# EAGLE schematic chaves (EAGLE 7.6.0)
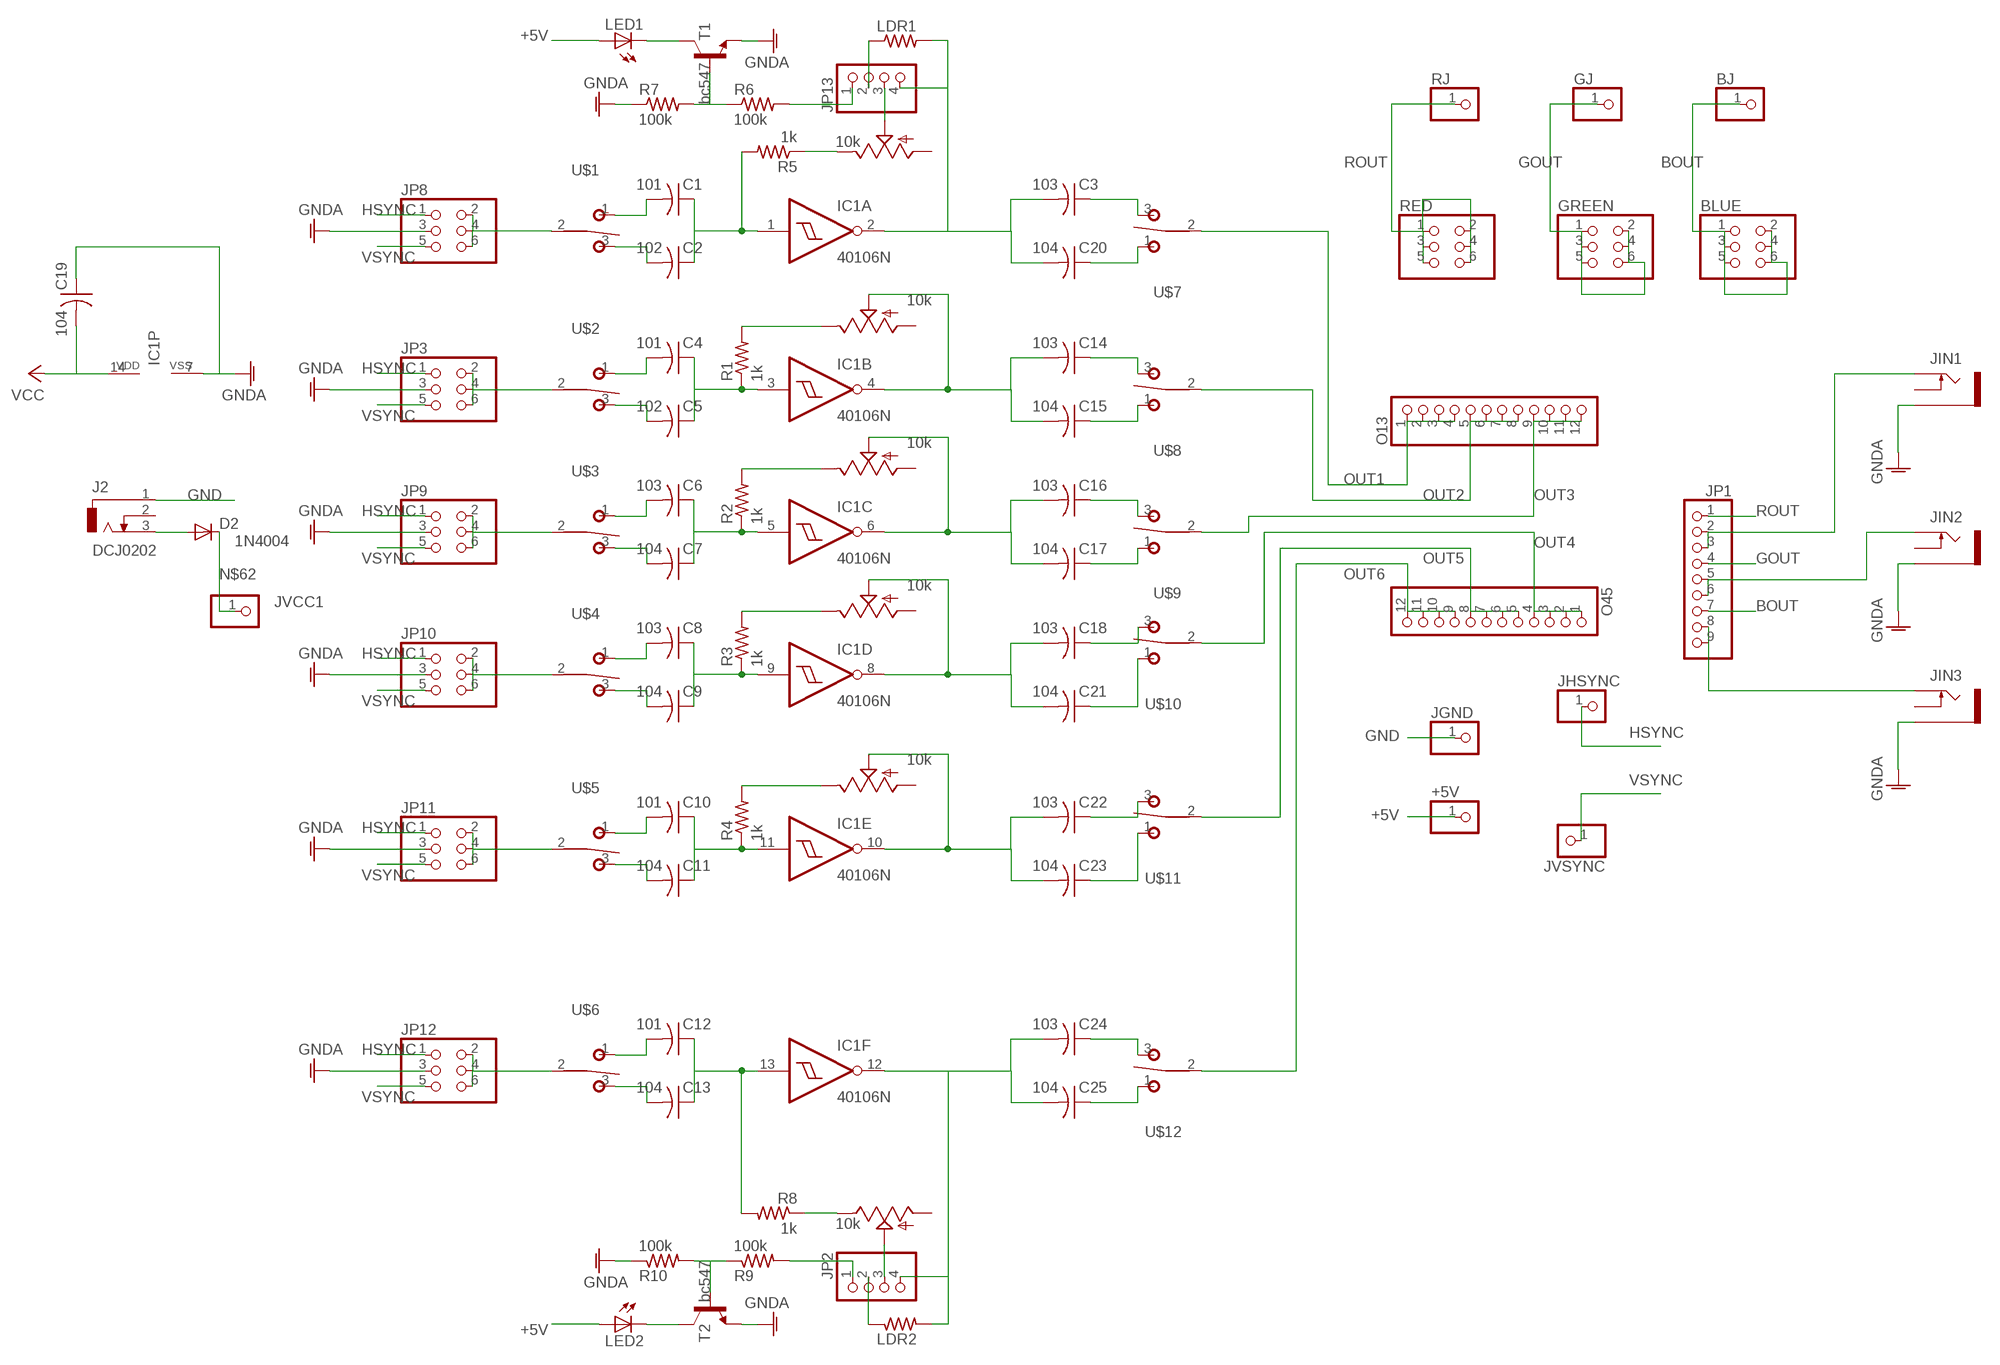
[diagram p0: schematic, sheet 1]

## Parts
+5V  PINHD-1X1  [1X01]
BJ  PINHD-1X1  [1X01]
BLUE  PINHD-2X3  [2X03]
C1  101  C-US050-025X075  [C050-025X075]
C2  102  C-US050-025X075  [C050-025X075]
C3  103  C-US050-025X075  [C050-025X075]
C4  101  C-US050-025X075  [C050-025X075]
C5  102  C-US050-025X075  [C050-025X075]
C6  103  C-US050-025X075  [C050-025X075]
C7  104  C-US050-025X075  [C050-025X075]
C8  103  C-US050-025X075  [C050-025X075]
C9  104  C-US050-025X075  [C050-025X075]
C10  101  C-US050-025X075  [C050-025X075]
C11  104  C-US050-025X075  [C050-025X075]
C12  101  C-US050-025X075  [C050-025X075]
C13  104  C-US050-025X075  [C050-025X075]
C14  103  C-US050-025X075  [C050-025X075]
C15  104  C-US050-025X075  [C050-025X075]
C16  103  C-US050-025X075  [C050-025X075]
C17  104  C-US050-025X075  [C050-025X075]
C18  103  C-US050-025X075  [C050-025X075]
C19  104  C-US050-025X075  [C050-025X075]
C20  104  C-US050-025X075  [C050-025X075]
C21  104  C-US050-025X075  [C050-025X075]
C22  103  C-US050-025X075  [C050-025X075]
C23  104  C-US050-025X075  [C050-025X075]
C24  103  C-US050-025X075  [C050-025X075]
C25  104  C-US050-025X075  [C050-025X075]
D2  1N4004  [DO41-10]
GJ  PINHD-1X1  [1X01]
GREEN  PINHD-2X3  [2X03]
IC1  40106N  [DIL14]
J2  DCJ0202  [DCJ0202]
JGND  PINHD-1X1  [1X01]
JHSYNC  PINHD-1X1  [1X01]
JIN1  PJ302M  [PJ302M]
JIN2  PJ302M  [PJ302M]
JIN3  PJ302M  [PJ302M]
JP1  PINHD-1X9  [1X09-BIG]
JP2  PINHD-1X4  [1X04]
JP3  PINHD-2X3  [2X03]
JP8  PINHD-2X3  [2X03]
JP9  PINHD-2X3  [2X03]
JP10  PINHD-2X3  [2X03]
JP11  PINHD-2X3  [2X03]
JP12  PINHD-2X3  [2X03]
JP13  PINHD-1X4  [1X04]
JVCC1  PINHD-1X1  [1X01]
JVSYNC  PINHD-1X1  [1X01]
LDR1  R-US_0204/2V  [0204V]
LDR2  R-US_0204/2V  [0204V]
LED1  LED5MM  [LED5MM]
LED2  LED5MM  [LED5MM]
O13  PINHD-1X12-CB  [1X12-CB]
O45  PINHD-1X12-CB  [1X12-CB]
POT1  10k  POT_USVERTICAL  [ALPS_POT_VERTICAL]
POT2  10k  POT_USVERTICAL  [ALPS_POT_VERTICAL]
POT3  10k  POT_USVERTICAL  [ALPS_POT_VERTICAL]
POT4  10k  POT_USVERTICAL  [ALPS_POT_VERTICAL]
POT5  10k  POT_USVERTICAL  [ALPS_POT_VERTICAL]
POT6  10k  POT_USVERTICAL  [ALPS_POT_VERTICAL]
R1  1k  R-US_0204/2V  [0204V]
R2  1k  R-US_0204/2V  [0204V]
R3  1k  R-US_0204/2V  [0204V]
R4  1k  R-US_0204/2V  [0204V]
R5  1k  R-US_0204/2V  [0204V]
R6  100k  R-US_0204/2V  [0204V]
R7  100k  R-US_0204/2V  [0204V]
R8  1k  R-US_0204/2V  [0204V]
R9  100k  R-US_0204/2V  [0204V]
R10  100k  R-US_0204/2V  [0204V]
RED  PINHD-2X3  [2X03]
RJ  PINHD-1X1  [1X01]
T1  bc547  -NPN-TO92-ECB  [TO92-ECB]
T2  bc547  -NPN-TO92-ECB  [TO92-ECB]
U$1  T-80-T-SPDT-ON-OFF-ON  [M9040P]
U$2  T-80-T-SPDT-ON-OFF-ON  [M9040P]
U$3  T-80-T-SPDT-ON-OFF-ON  [M9040P]
U$4  T-80-T-SPDT-ON-OFF-ON  [M9040P]
U$5  T-80-T-SPDT-ON-OFF-ON  [M9040P]
U$6  T-80-T-SPDT-ON-OFF-ON  [M9040P]
U$7  T-80-T-SPDT-ON-OFF-ON  [M9040P]
U$8  T-80-T-SPDT-ON-OFF-ON  [M9040P]
U$9  T-80-T-SPDT-ON-OFF-ON  [M9040P]
U$10  T-80-T-SPDT-ON-OFF-ON  [M9040P]
U$11  T-80-T-SPDT-ON-OFF-ON  [M9040P]
U$12  T-80-T-SPDT-ON-OFF-ON  [M9040P]

## Nets
+5V: +5V.1 C19.2 IC1.14(P:VDD) LED1.A LED2.A ; supply symbol labelled VCC
BOUT: BJ.1 BLUE.1 BLUE.2 BLUE.3 BLUE.4 BLUE.5 BLUE.6 JP1.7
GND: C19.1 IC1.7(P:VSS) J2.1 JGND.1 JIN1.GND(SLEEVE) JIN2.GND(SLEEVE) JIN3.GND(SLEEVE) JP3.3 JP8.3 JP9.3 JP10.3 JP11.3 JP12.3 R7.1 R10.1 T1.E T2.E ; supply symbol labelled GNDA
GOUT: GJ.1 GREEN.1 GREEN.2 GREEN.3 GREEN.4 GREEN.5 GREEN.6 JP1.4
HSYNC: JHSYNC.1 JP3.1 JP8.1 JP9.1 JP10.1 JP11.1 JP12.1
N$1: C1.2 U$1.1(O)
N$2: C2.2 U$1.3(S)
N$3: JP13.2 LDR1.1
N$4: C5.2 U$2.3(S)
N$5: C4.2 U$2.1(O)
N$6: JP13.3 POT1.P$2(S)
N$7: C8.2 U$4.1(O)
N$8: C9.2 U$4.3(S)
N$9: JIN1.TIP JP1.2 JP1.3
N$10: C6.2 U$3.1(O)
N$11: C7.2 U$3.3(S)
N$12: JIN2.TIP JP1.5 JP1.6
N$13: JIN3.TIP JP1.8 JP1.9
N$14: JP3.2 JP3.4 JP3.6 U$2.2(P)
N$16: C20.1 U$7.1(O)
N$17: C3.1 U$7.3(S)
N$19: POT1.P$1(E) R5.1
N$20: JP8.2 JP8.4 JP8.6 U$1.2(P)
N$22: POT2.P$1(E) R1.2
N$23: JP9.2 JP9.4 JP9.6 U$3.2(P)
N$24: C15.1 U$8.1(O)
N$26: C14.1 U$8.3(S)
N$28: C17.1 U$9.1(O)
N$29: C16.1 U$9.3(S)
N$31: JP10.2 JP10.4 JP10.6 U$4.2(P)
N$32: R6.1 R7.2 T1.B
N$33: POT3.P$1(E) R2.2
N$34: JP13.1 R6.2
N$35: JP11.2 JP11.4 JP11.6 U$5.2(P)
N$36: JP12.2 JP12.4 JP12.6 U$6.2(P)
N$37: C21.1 U$10.1(O)
N$38: C18.1 U$10.3(S)
N$40: C23.1 U$11.1(O)
N$41: C22.1 U$11.3(S)
N$43: C25.1 U$12.1(O)
N$44: C24.1 U$12.3(S)
N$46: C10.2 U$5.1(O)
N$47: POT4.P$1(E) R3.2
N$48: C11.2 U$5.3(S)
N$49: C13.2 U$6.3(S)
N$50: C12.2 U$6.1(O)
N$52: LED1.K(C) T1.C
N$53: POT5.P$1(E) R4.2
N$55: C24.2 C25.2 IC1.12(F:O) JP2.4 LDR2.2
N$56: JP2.2 LDR2.1
N$57: JP2.3 POT6.P$2(S)
N$58: POT6.P$1(E) R8.1
N$59: R9.1 R10.2 T2.B
N$60: JP2.1 R9.2
N$61: LED2.K(C) T2.C
N$62: D2.C JVCC1.1
N$101: C3.2 C20.2 IC1.2(A:O) JP13.4 LDR1.2
N$102: C14.2 C15.2 IC1.4(B:O) POT2.P$2(S)
N$103: C16.2 C17.2 IC1.6(C:O) POT3.P$2(S)
N$104: C18.2 C21.2 IC1.8(D:O) POT4.P$2(S)
N$105: C22.2 C23.2 IC1.10(E:O) POT5.P$2(S)
OUT1: O13.1 O13.2 O13.3 O13.4 U$7.2(P)
OUT2: O13.5 O13.6 O13.7 O13.8 U$8.2(P)
OUT3: O13.9 O13.10 O13.11 O13.12 U$9.2(P)
OUT4: O45.1 O45.2 O45.3 O45.4 U$10.2(P)
OUT5: O45.5 O45.6 O45.7 O45.8 U$11.2(P)
OUT6: O45.9 O45.10 O45.11 O45.12 U$12.2(P)
ROUT: JP1.1 RED.1 RED.2 RED.3 RED.4 RED.5 RED.6 RJ.1
SS1: C1.1 C2.1 IC1.1(A:I) R5.2
SS2: C4.1 C5.1 IC1.3(B:I) R1.1
SS3: C6.1 C7.1 IC1.5(C:I) R2.1
SS4: C8.1 C9.1 IC1.9(D:I) R3.1
SS5: C10.1 C11.1 IC1.11(E:I) R4.1
SS6: C12.1 C13.1 IC1.13(F:I) R8.2
VIN: D2.A J2.3
VSYNC: JP3.5 JP8.5 JP9.5 JP10.5 JP11.5 JP12.5 JVSYNC.1
Unconnected: J2.2 JIN1.SW(SWITCH) JIN2.SW(SWITCH) JIN3.SW(SWITCH) POT1.P$3(A) POT2.P$3(A) POT3.P$3(A) POT4.P$3(A) POT5.P$3(A) POT6.P$3(A)

## Library data of the parts
+5V BJ GJ JGND JHSYNC JVCC1 JVSYNC RJ = adafruit:PINHD-1X1: Pin header 1x1 for 0.1" spacing With round pins
BLUE GREEN JP3 JP8-JP12 RED = pinhead:PINHD-2X3: PIN HEADER
C1-C25 = adafruit:C-US: CAPACITOR, American symbol
D2 = diode:1N4004: DIODE general purpose rectifier, 1 A
IC1 = 40xx:40106: Hex SCHMITT TRIGGER
J2 = con-jack:DCJ0202: DC POWER JACK Source: DCJ0202.pdf
JIN1-JIN3 = pj302m:PJ302M: PJ302M horizontal / right angled mount 3.5 mm jack socket
JP1 = adafruit:PINHD-1X9: Pin header 1x10 0.1" spacing With round pins
JP2 JP13 = pinhead:PINHD-1X4: PIN HEADER
LDR1 LDR2 R1-R10 = adafruit:R-US_: RESISTOR, American symbol
LED1 LED2 = adafruit:LED: LED OSRAM: - CHIPLED LG R971, LG N971, LY N971, LG Q971, LY Q971, LO R971, LY R971 LH N974, LH R974 LS Q976, LO Q976, LY Q976 LO Q996 - Hyper CHIPLED LW Q18S LB Q993, LB Q99A, LB R99A - SideLED LS A670, LO A670, LY A670, LG A670, LP A670 LB A673, LV A673, LT A673, LW A673 LH A674 LY A675 LS A676, LA A676, LO A676, LY A676, LW A676 LS A679, LY A679, LG A679 - Hyper Micro SIDELED® LS Y876, LA Y876, LO Y876, LY Y876 LT Y87S - SmartLED LW L88C, LW L88S LB L89C, LB L89S, LG L890 LS L89K, LO L89K, LY L89K LS L896, LA L896, LO L896, LY L896 - TOPLED LS T670, LO T670, LY T670, LG T670, LP T670 LSG T670, LSP T670, LSY T670, LOP T670, LYG T670 LG T671, LOG T671, LSG T671 LB T673, LV T673, LT T673, LW T673 LH T674 LS T676, LA T676, LO T676, LY T676, LB T676, LH T676, LSB T676, LW T676 LB T67C, LV T67C, LT T67C, LS T67K, LO T67K, LY T67K, LW E67C LS E67B, LA E67B, LO E67B, LY E67B, LB E67C, LV E67C, LT E67C LW T67C LS T679, LY T679, LG T679 LS T770, LO T770, LY T770, LG T770, LP T770 LB T773, LV T773, LT T773, LW T773 LH T774 LS E675, LA E675, LY E675, LS T675 LS T776, LA T776, LO T776, LY T776, LB T776 LHGB T686 LT T68C, LB T68C - Hyper Mini TOPLED® LB M676 - Mini TOPLED Santana® LG M470 LS M47K, LO M47K, LY M47K Source: http://www.osram.convergy.de/
O13 O45 = adafruit:PINHD-1X12: PIN HEADER
POT1-POT6 = pot-alps:POT_US
T1 T2 = MusicThingModular:*-NPN-: NPN Transistror BF959 corrected 2008.03.06
U$1-U$12 = MusicThingModular:T-80-T-SPDT-ON-OFF-ON